# EAGLE design openenergy (EAGLE 7.2.0)
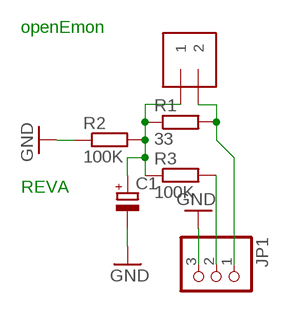
[diagram p0: schematic, sheet 1]

## Parts
C1  CPOL-EUB45181A  [B45181A]
J1  1X2-3.5MM  [1X2-3.5MM]
JP1  PINHD-1X3  [1X03]
R1  33  R-EU_0204/5  [0204/5]
R2  100K  R-EU_0204/5  [0204/5]
R3  100K  R-EU_0204/5  [0204/5]

## Nets
GND: C1.- JP1.3 R2.1
N$1: C1.+ J1.1 R1.1 R2.2 R3.1
N$2: J1.2 JP1.1 R1.2
N$3: JP1.2 R3.2

## Notes on the sheet
- openEmon
- REVA

## Library data of the parts
C1 = rcl:CPOL-EU: POLARIZED CAPACITOR, European symbol
J1 = adafruit:1X2: 3.5mm Terminal block http://www.ladyada.net/library/pcb/eaglelibrary.html
JP1 = adafruit:PINHD-1X3: PIN HEADER
R1-R3 = resistor:R-EU_: RESISTOR, European symbol

## Board
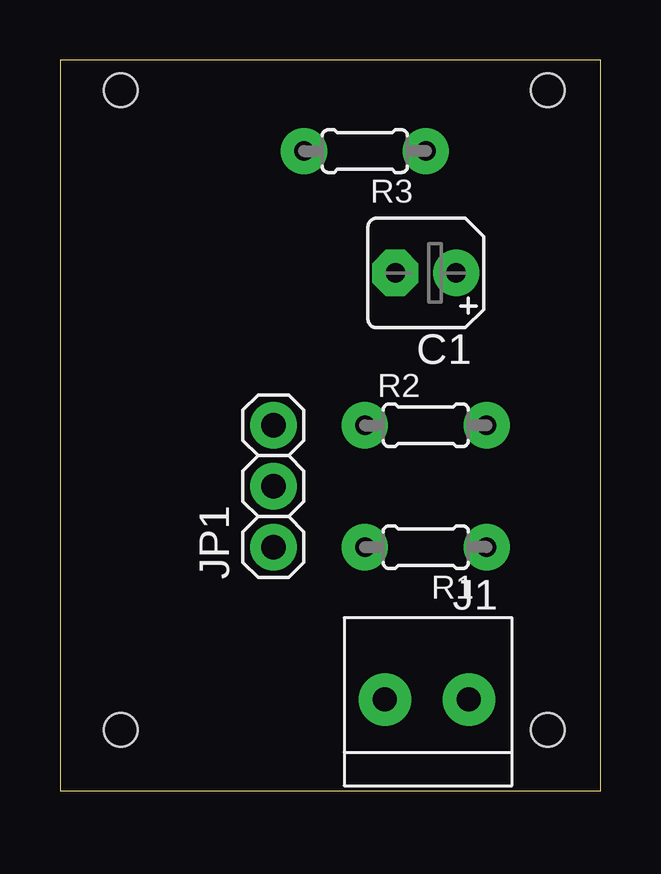
[diagram p1: board, top side]
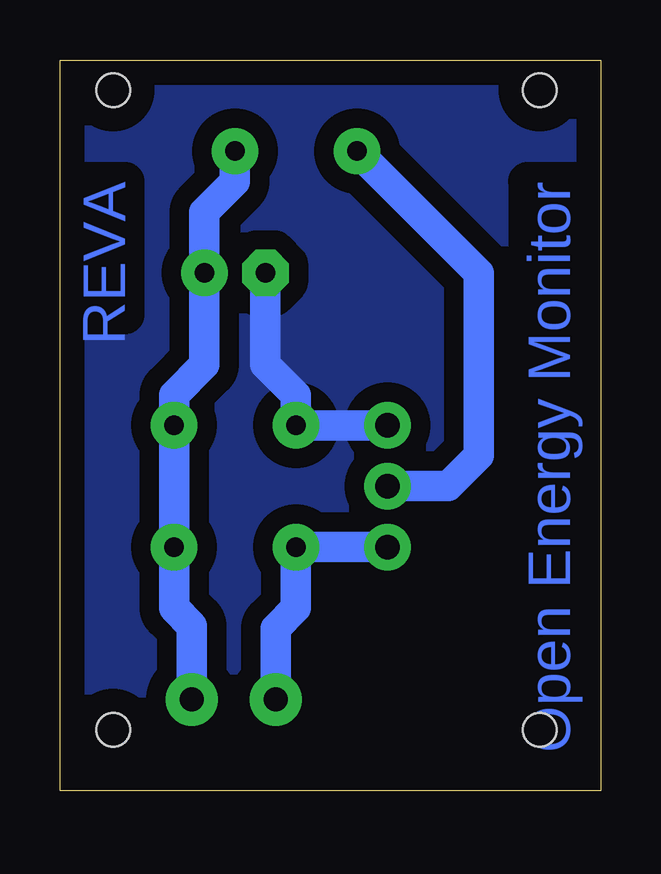
[diagram p2: board, bottom side, seen from below]

Size 22.53 x 30.47 mm. Coordinates in mm from the lower left corner, seen from the top.
Outline: 0,0 22.53,0 22.53,30.47 0,30.47 0,0
Copper layers (1*16): Top 0.035mm / dielectric 1.5mm / Bottom 0.035mm
Design rules "default": minimum track width 10mil, minimum drill 24mil, track to track 8mil, track to pad 8mil, pad to pad 8mil, via to via 8mil, smd to smd 8mil, copper to edge 40mil, drill to drill 8mil, minimum pad ring 10mil, minimum via ring 8mil, stop-mask expansion 4mil, vias tented up to drill 0mil, thermal gap 10mil
Holes 1.4 mm at 2.54,29.21 2.54,2.54 20.32,29.21 20.32,2.54

### Footprints (pad centres in the part's own frame; a part is rotated, then mirrored left to right if it is on the bottom)
B45181A = drill 0.813 pad 1.6: + -1.27,0 | drill 0.813 pad 1.6 octagon: - 1.27,0
1X2-3.5MM = drill 1 pad 2.184: 1 1.8,0; 2 -1.7,0
1X03 = drill 1.016: 1 -2.54,0; 2 0,0; 3 2.54,0
0204/5 = drill 0.813 octagon: 1 -2.54,0; 2 2.54,0

### Placement (x,y rotation side)
C1  15.24,21.59 180 top
J1  15.24,3.81 0 top
JP1  8.89,12.7 90 top
R1  15.24,10.16 180 top
R2  15.24,15.24 0 top
R3  12.7,26.67 180 top

### Tracks (layer width: path | path; a pad name or v marks a point on that pad's centre or on a via)
GND
  Bottom 1.27: C1.- 13.97,17.78 12.7,16.51 R2.1 JP1.3
  pour Bottom (isolate 0.813): 0,30.48 0,0 22.86,0 22.86,30.48
N$1
  Bottom 1.27: J1.1 17.04,6.88 17.78,7.62 R1.1 R2.2 17.78,16.51 16.51,17.78 C1.+ 16.51,24.13 15.24,25.4 R3.1
N$2
  Bottom 1.27: JP1.1 R1.2 12.7,7.62 13.54,6.78 J1.2
N$3
  Bottom 1.27: JP1.2 6.35,12.7 5.08,13.97 5.08,21.59 R3.2
N$4  (via drill 0.6 pad 1.93)
  other vias: 8.89,15.24
N$5  (via drill 0.6 pad 1.93)
  other vias: 8.89,12.7
N$6  (via drill 0.6 pad 1.93)
  other vias: 8.89,10.16
N$7  (via drill 0.6 pad 1.93)
  other vias: 17.78,10.16
N$8  (via drill 0.6 pad 1.93)
  other vias: 12.7,10.16
N$9  (via drill 0.6 pad 1.93)
  other vias: 17.78,15.24
N$10  (via drill 0.6 pad 1.93)
  other vias: 12.7,15.24
N$11  (via drill 0.6 pad 1.93)
  other vias: 15.24,26.67
N$12  (via drill 0.6 pad 1.93)
  other vias: 10.16,26.67
N$13  (via drill 0.6 pad 1.93)
  other vias: 13.97,21.59
N$14  (via drill 0.6 pad 1.93)
  other vias: 16.51,21.59

### Text on the board
Bottom: Open Energy Monitor | REVA